# EAGLE schematic CAN_Shield (EAGLE 7.5.0)
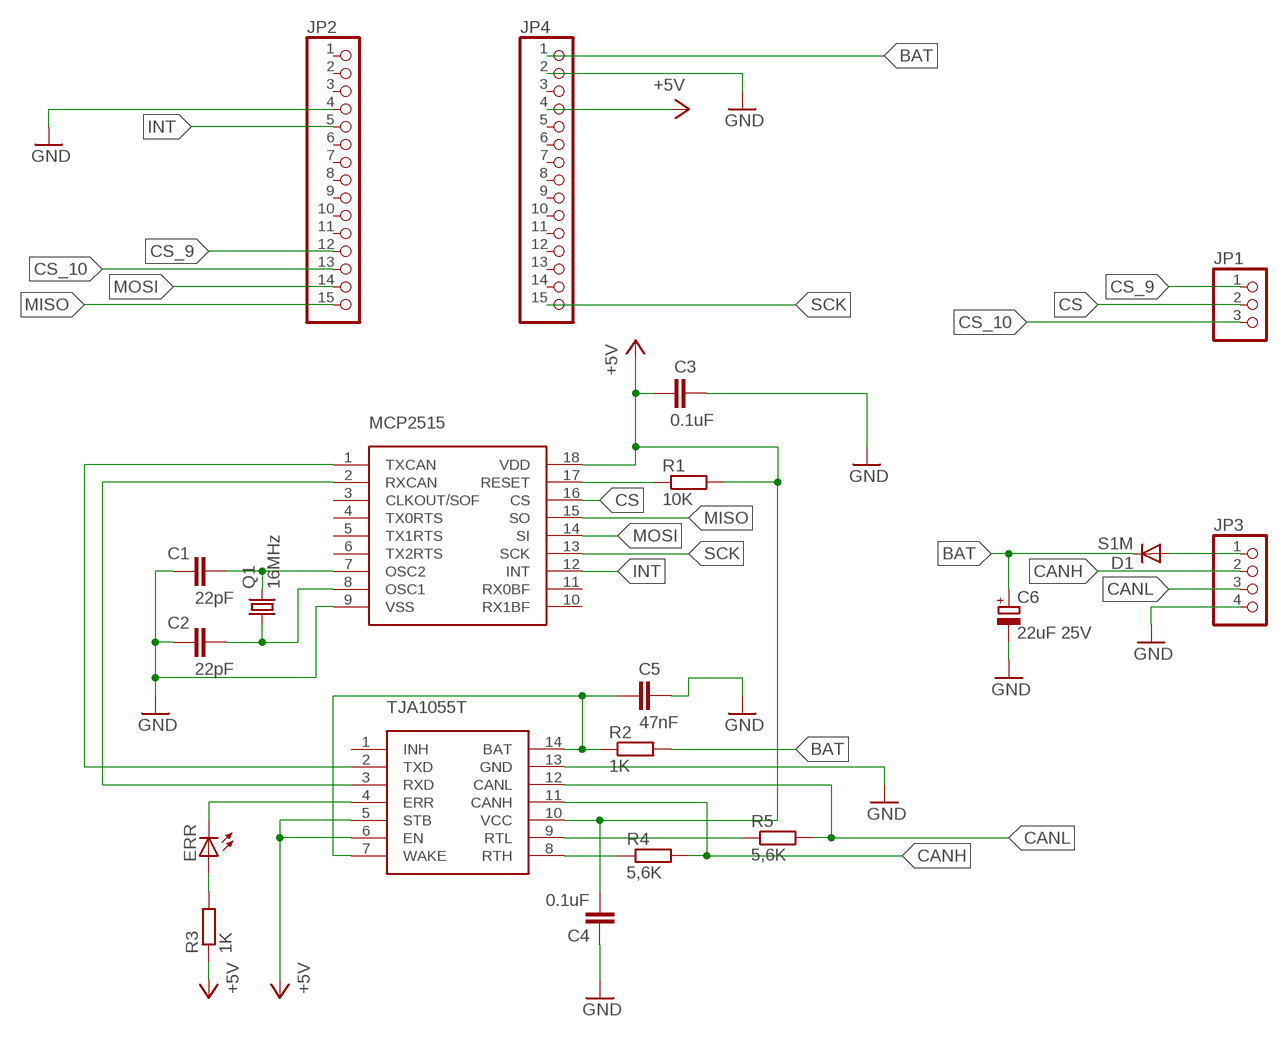
[diagram p0: schematic, sheet 1]

## Parts
C1  22pF  C-EUC0805  [C0805]
C2  22pF  C-EUC0805  [C0805]
C3  0.1uF  C-EUC0805  [C0805]
C4  0.1uF  C-EUC0805  [C0805]
C5  47nF  C-EUC0805  [C0805]
C6  22uF 25V  CPOL-EUSMCC  [SMC_C]
D1  S1M  [SMA]
ERR  LEDCHIP-LED0805  [CHIP-LED0805]
JP1  PINHD-1X3  [1X03]
JP2  PINHD-1X15  [1X15]
JP3  PINHD-1X4-1  [1X04]
JP4  PINHD-1X15  [1X15]
MCP2515  MCP2515  [SO18-1]
Q1  16MHz  CRYSTALHC49S  [HC49/S]
R1  10K  R-EU_R0805  [R0805]
R2  1K  R-EU_R0805  [R0805]
R3  1K  R-EU_R0805  [R0805]
R4  5,6K  R-EU_R0805  [R0805]
R5  5,6K  R-EU_R0805  [R0805]
TJA1055T  TJA1055T  [SO-14W]

## Nets
+5V: C3.1 C4.2 JP4.4 MCP2515.18(VDD) R1.2 R3.1 TJA1055T.5(STB) TJA1055T.6(EN) TJA1055T.10(VCC)
BAT: C6.+ D1.C JP4.1 R2.2
CANH: JP3.2 R4.2 TJA1055T.11(CANH)
CANL: JP3.3 R5.2 TJA1055T.12(CANL)
CS: JP1.2 MCP2515.16(CS)
CS_9: JP1.1 JP2.12
CS_10: JP1.3 JP2.13
GND: C1.1 C2.1 C3.2 C4.1 C5.2 C6.- JP2.4 JP3.4 JP4.2 MCP2515.9(VSS) TJA1055T.13(GND)
INT: JP2.5 MCP2515.12(INT)
MISO: JP2.15 MCP2515.15(SO)
MOSI: JP2.14 MCP2515.14(SI)
N$1: MCP2515.1(TXCAN) TJA1055T.2(TXD)
N$2: MCP2515.2(RXCAN) TJA1055T.3(RXD)
N$3: C1.2 MCP2515.7(OSC2) Q1.2
N$4: D1.A JP3.1
N$5: C2.2 MCP2515.8(OSC1) Q1.1
N$6: C5.1 R2.1 TJA1055T.7(WAKE) TJA1055T.14(BAT)
N$7: MCP2515.17(RESET) R1.1
N$8: R4.1 TJA1055T.8(RTH)
N$9: R5.1 TJA1055T.9(RTL)
N$10: ERR.C TJA1055T.4(ERR)
N$11: ERR.A R3.2
SCK: JP4.15 MCP2515.13(SCK)
Unconnected: JP2.1 JP2.2 JP2.3 JP2.6 JP2.7 JP2.8 JP2.9 JP2.10 JP2.11 JP4.3 JP4.5 JP4.6 JP4.7 JP4.8 JP4.9 JP4.10 JP4.11 JP4.12 JP4.13 JP4.14 MCP2515.3(CLKOUT/SOF) MCP2515.4(TX0RTS) MCP2515.5(TX1RTS) MCP2515.6(TX2RTS) MCP2515.10(RX1BF) MCP2515.11(RX0BF) TJA1055T.1(INH)

## Library data of the parts
C1-C5 = rcl:C-EU: CAPACITOR, European symbol
C6 = rcl:CPOL-EU: POLARIZED CAPACITOR, European symbol
D1 = diode:S1M
ERR = led:LED: LED OSRAM: - CHIPLED LG R971, LG N971, LY N971, LG Q971, LY Q971, LO R971, LY R971 LH N974, LH R974 LS Q976, LO Q976, LY Q976 LO Q996 - Hyper CHIPLED LW Q18S LB Q993, LB Q99A, LB R99A - SideLED LS A670, LO A670, LY A670, LG A670, LP A670 LB A673, LV A673, LT A673, LW A673 LH A674 LY A675 LS A676, LA A676, LO A676, LY A676, LW A676 LS A679, LY A679, LG A679 - Hyper Micro SIDELED® LS Y876, LA Y876, LO Y876, LY Y876 LT Y87S - SmartLED LW L88C, LW L88S LB L89C, LB L89S, LG L890 LS L89K, LO L89K, LY L89K LS L896, LA L896, LO L896, LY L896 - TOPLED LS T670, LO T670, LY T670, LG T670, LP T670 LSG T670, LSP T670, LSY T670, LOP T670, LYG T670 LG T671, LOG T671, LSG T671 LB T673, LV T673, LT T673, LW T673 LH T674 LS T676, LA T676, LO T676, LY T676, LB T676, LH T676, LSB T676, LW T676 LB T67C, LV T67C, LT T67C, LS T67K, LO T67K, LY T67K, LW E67C LS E67B, LA E67B, LO E67B, LY E67B, LB E67C, LV E67C, LT E67C LW T67C LS T679, LY T679, LG T679 LS T770, LO T770, LY T770, LG T770, LP T770 LB T773, LV T773, LT T773, LW T773 LH T774 LS E675, LA E675, LY E675, LS T675 LS T776, LA T776, LO T776, LY T776, LB T776 LHGB T686 LT T68C, LB T68C - Hyper Mini TOPLED® LB M676 - Mini TOPLED Santana® LG M470 LS M47K, LO M47K, LY M47K Source: http://www.osram.convergy.de LUXEON: - LUMILED® LXK2-PW12-R00, LXK2-PW12-S00, LXK2-PW14-U00, LXK2-PW14-V00 LXK2-PM12-R00, LXK2-PM12-S00, LXK2-PM14-U00 LXK2-PE12-Q00, LXK2-PE12-R00, LXK2-PE12-S00, LXK2-PE14-T00, LXK2-PE14-U00 LXK2-PB12-K00, LXK2-PB12-L00, LXK2-PB12-M00, LXK2-PB14-N00, LXK2-PB14-P00, LXK2-PB14-Q00 LXK2-PR12-L00, LXK2-PR12-M00, LXK2-PR14-Q00, LXK2-PR14-R00 LXK2-PD12-Q00, LXK2-PD12-R00, LXK2-PD12-S00 LXK2-PH12-R00, LXK2-PH12-S00 LXK2-PL12-P00, LXK2-PL12-Q00, LXK2-PL12-R00 Source: www.luxeon.com KINGBRIGHT: KA-3528ASYC Source: www.kingbright.com
JP1 = CAN_Shiel_Lib:PINHD-1X3: PIN HEADER
JP2 JP4 = CAN_Shiel_Lib:PINHD-1X15: PIN HEADER
JP3 = CAN_Shiel_Lib:PINHD-1X4-1: PIN HEADER
MCP2515 = CAN_Shiel_Lib:MCP2515
Q1 = crystal:CRYSTAL: CRYSTAL; OC_FARNELL: 1667008; OC_NEWARK: unknown
R1-R5 = rcl:R-EU_: RESISTOR, European symbol
TJA1055T = CAN_Shiel_Lib:TJA1055T